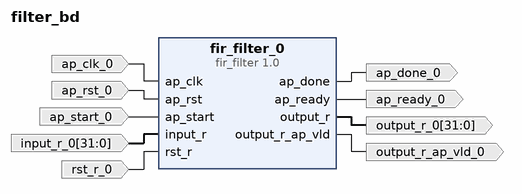
[diagram p0: block diagram of the top level]
# Vivado block design filter_bd, xc7a35tcpg236-1, Vivado 2025.2.1
create_bd_design filter_bd

create_bd_port -dir I -type clk ap_clk_0
create_bd_port -dir I -type rst ap_rst_0
set_property -dict {CONFIG.POLARITY ACTIVE_HIGH} [get_bd_ports ap_rst_0]
create_bd_port -dir I -type data rst_r_0
create_bd_port -dir I -from 31 -to 0 -type data input_r_0
create_bd_port -dir O output_r_ap_vld_0
create_bd_port -dir O -from 31 -to 0 -type data output_r_0
create_bd_port -dir O ap_done_0
create_bd_port -dir O ap_ready_0
create_bd_port -dir I ap_start_0

create_bd_cell -type ip -vlnv xilinx.com:hls:fir_filter:1.0 fir_filter_0

# ---- connections ----

connect_bd_net -net ap_clk_0_1 [get_bd_ports ap_clk_0] [get_bd_pins fir_filter_0/ap_clk]
connect_bd_net -net ap_rst_0_1 [get_bd_ports ap_rst_0] [get_bd_pins fir_filter_0/ap_rst]
connect_bd_net -net ap_start_0_1 [get_bd_ports ap_start_0] [get_bd_pins fir_filter_0/ap_start]
connect_bd_net [get_bd_pins fir_filter_0/ap_done] [get_bd_ports ap_done_0]
connect_bd_net [get_bd_pins fir_filter_0/ap_ready] [get_bd_ports ap_ready_0]
connect_bd_net [get_bd_pins fir_filter_0/output_r] [get_bd_ports output_r_0]
connect_bd_net [get_bd_pins fir_filter_0/output_r_ap_vld] [get_bd_ports output_r_ap_vld_0]
connect_bd_net -net input_r_0_1 [get_bd_ports input_r_0] [get_bd_pins fir_filter_0/input_r]
connect_bd_net -net rst_r_0_1 [get_bd_ports rst_r_0] [get_bd_pins fir_filter_0/rst_r]

validate_bd_design
save_bd_design
